# EasyEDA Pro project 03_SigPart.epro

# Schematic Schematic3
Create Date: 2024-06-30; Page Name: P1; Project Name: 264母板; Schematic Name: Schematic3; Update Date: 2024-08-02; Company: 嘉立创EDA; Page Size: A3; Version: V1.0
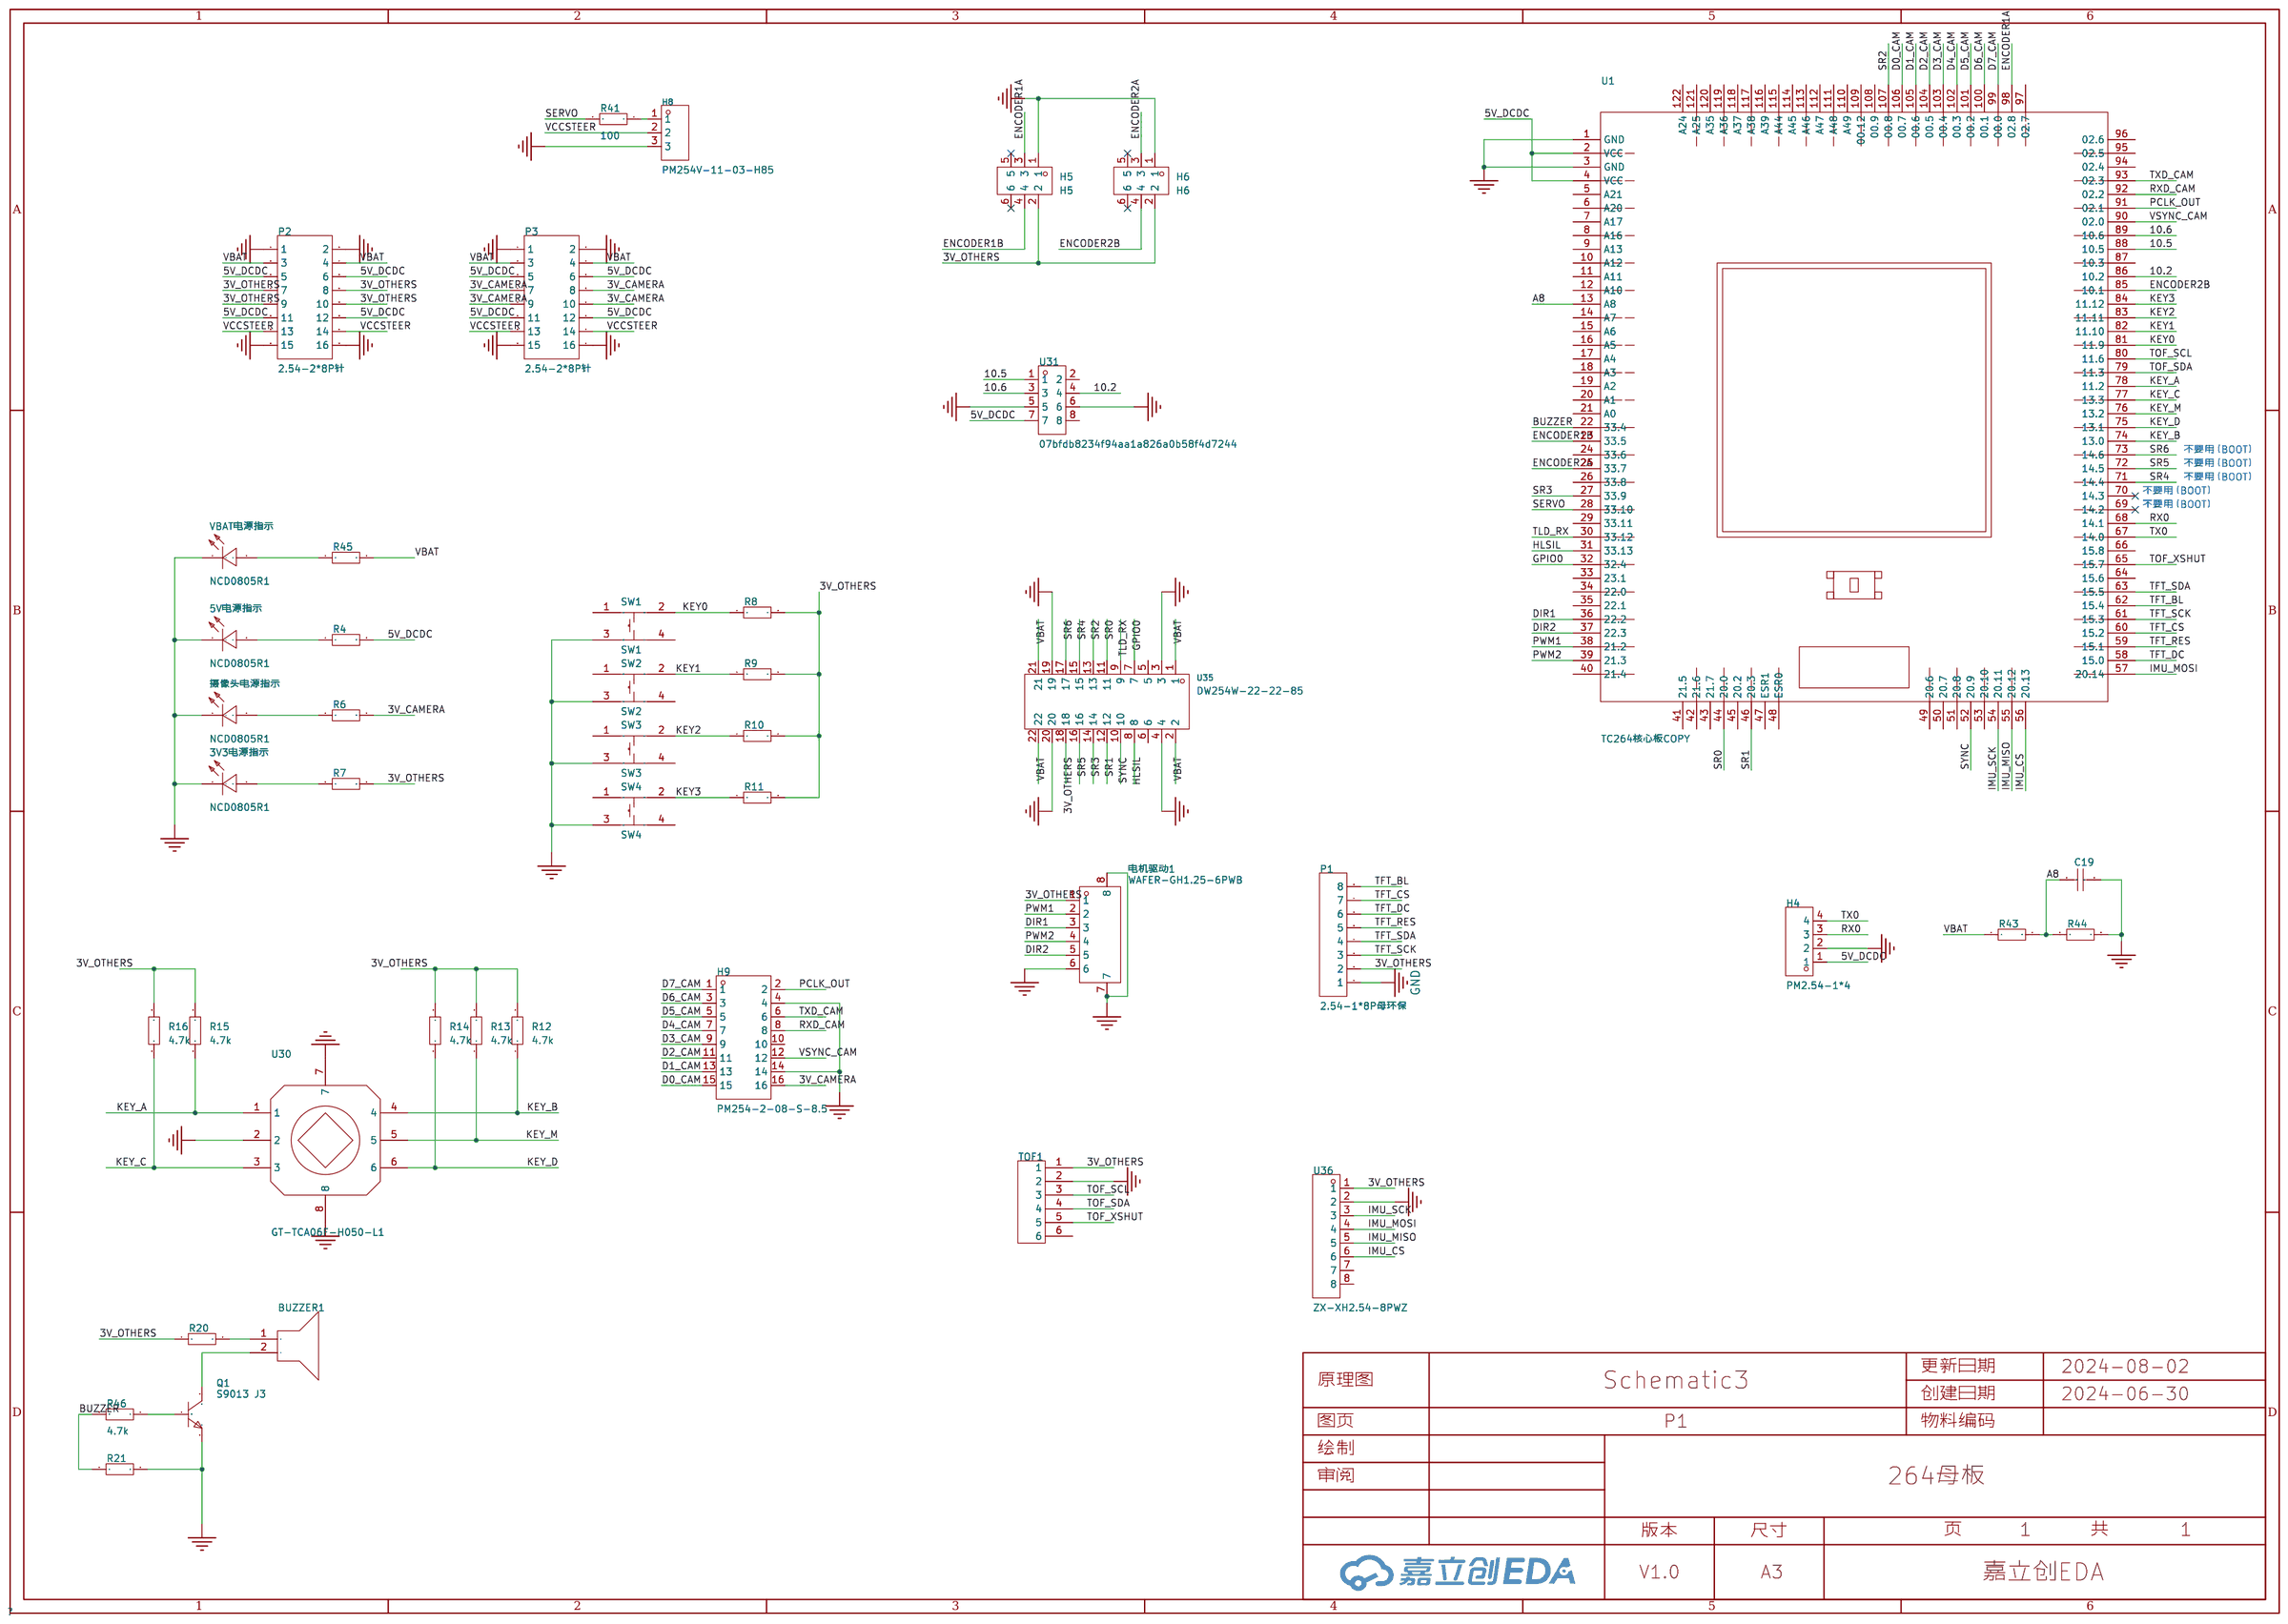
[diagram p0: schematic sheet]

## Parts
3V3电源指示  NCD0805R1  [LED0805-RD]
5V电源指示  NCD0805R1  [LED0805-RD]
BUZZER1  SFN-1270-0540-35P5.0  [BUZ-TH_BD12.5-P5.00-D0.9]
C19  100nF  [C0805]
H4  PM2.54-1*4  [HDR-TH_4P-P2.54-V-F]
H5  H5  [HDR-SMD_6P-P2.54-V-M-R2-C5-S7.4]
H6  H6  [HDR-SMD_6P-P2.54-V-M-R2-C5-S7.4]
H8  PM254V-11-03-H85  [HDR-TH_3P-P2.54-V-F]
H9  PM254-2-08-S-8.5  [HDR-SMD_16P-P2.54-V-F-R2-C8-LS7.1]
P1  2.54-1*8P母环保  [HDR-TH_8P-P2.54-V-F-1]
P2  2.54-2*8P针  [HDR-TH_16P-P2.54-V-M-R2-C8-S2.54]
P3  2.54-2*8P针  [HDR-TH_16P-P2.54-V-M-R2-C8-S2.54]
Q1  S9013 J3  [SOT-23-3_L2.9-W1.3-P1.90-LS2.4-BR]
R4  4.7k  [R0805]
R6  4.7k  [R0805]
R7  4.7k  [R0805]
R8  4.7k  [R0805]
R9  4.7k  [R0805]
R10  4.7k  [R0805]
R11  4.7k  [R0805]
R12  4.7k  [R0805]
R13  4.7k  [R0805]
R14  4.7k  [R0805]
R15  4.7k  [R0805]
R16  4.7k  [R0805]
R20  10R  [R0805]
R21  10k  [R0805]
R41  100  [R0805]
R43  30k  [R0805]
R44  10k  [R0805]
R45  4.7k  [R0805]
R46  4.7k  [R0805]
SW1  SW1  [SW-SMD_4P-L4.2-W3.3-P2.15-LS5.1]
SW2  SW2  [SW-SMD_4P-L4.2-W3.3-P2.15-LS5.1]
SW3  SW3  [SW-SMD_4P-L4.2-W3.3-P2.15-LS5.1]
SW4  SW4  [SW-SMD_4P-L4.2-W3.3-P2.15-LS5.1]
TOF1  -  [CONN-TH_6P-P2.50_XH-6A]
U1  TC264核心板COPY  [TC264逐飞]
U30  GT-TCA06F-H050-L1  [KEY-SMD_GT-TCA06F-H050-L1]
U31  07bfdb8234f94aa1a826a0b58f4d7244  [HDR-TH_8P-P2.54-V-F-R2-C4-S2.54]
U35  DW254W-22-22-85  [CONN-TH_22P-P2.54_DEALON_DW254W-22-22-85]
U36  ZX-XH2.54-8PWZ  [CONN-TH_8P-P2.50_ZX-XH2.54-8PWZ]
VBAT电源指示  NCD0805R1  [LED0805-RD]
摄像头电源指示  NCD0805R1  [LED0805-RD]
电机驱动1  WAFER-GH1.25-6PWB  [CONN-SMD_6P-P1.25_XUNPU_WAFER-GH1.25-6PWB]

## Library data of the parts
3V3电源指示 5V电源指示 VBAT电源指示 摄像头电源指示 = LED_0805: 发光颜色:红灯;; LCSC Part Name: 红灯; Supplier Part: C84256; Manufacturer: 国星光电; Supplier Footprint: 0805; JLCPCB Part Class: 基础库; Datasheet: https://atta.szlcsc.com/upload/public/pdf/source/20200820/C84256_F0A75A43B3EAD75808600A0514C76B99.pdf; Supplier: LCSC; Emitted Color: 红灯
BUZZER1 = BUZZER: 驱动方式：无源(外部驱动) 构造类型：压电式 额定电压：5V 频率：4000Hz 声压(SPL)：80dB@5V,10cm 直径(φD)：12.6mm 高度：7.5mm; Supplier Part: C3015481; Manufacturer: SS(海旭); Supplier Footprint: 插件,D=12.5mm; JLCPCB Part Class: 扩展库; Datasheet: https://atta.szlcsc.com/upload/public/pdf/source/20220517/E2F404692071743447D3DA4216E14D26.pdf; Supplier: LCSC
C19 = 电容-0805C
H4 = PM2.54-1*4: 排数:单排;总孔位数:4;间距:2.54mm;插孔结构:1x4P;行距:2.54mm;安装类型:直插;圆孔/方孔:方孔;额定电流:2.5A;插孔方向:顶部;塑高:8.5mm;工作温度范围:-40℃~+105℃;; LCSC Part Name: 2.54mm 1x4P; Supplier Part: C5116530; Manufacturer: ZHOURI(洲日); Supplier Footprint: 插件,P=2.54mm; JLCPCB Part Class: 扩展库; Datasheet: https://atta.szlcsc.com/upload/public/pdf/source/20220729/3385E3C3A9122AF204A83235A2975C64.pdf; Supplier: LCSC; Number of Rows: 单排; Number of Holes: 4; Pitch: 2.54mm; Holes Structure: 1x4P; Row Spacing: 2.54mm; Mounting Type: 直插; Circular Hole / Square Hole: 方孔; Current Rating (Max): 2.5A; Holes Direction: 顶部; Insulation Height: 8.5mm; Operating Temperature Range: -40℃~+105℃
H5 H6 = X6521WVS-2x03H-C60D74: 插针结构:2x3P;间距:2.54mm;行距:2.54mm;圆针/方针:方针;安装类型:立贴;排数:双排;总PIN位数:6P;额定电流:3A;额定电压:250V;配合针长度:6mm;塑高:2.5mm;端接针长度:-;触头材质:黄铜;触头镀层:金;工作温度范围:-40℃~+105℃;焊接温度(最大值):260℃;颜色:黑色;; LCSC Part Name: 间距:2.54mm 2x3P 立贴 方针; Supplier Part: C780054; Manufacturer: XKB Connectivity(中国星坤); Supplier Footprint: SMD,P=2.54mm; Datasheet: https://atta.szlcsc.com/upload/public/pdf/source/20211009/E3239EE5247E6BAFECB8B74A4FCF9AB8.pdf; Supplier: LCSC; Pin Structure: 2x3P; Pitch: 2.54mm; Row Spacing: 2.54mm; Circluar Pins/Square Pins: 方针; Mounting Type: 立贴; Number of Rows: 双排; Number of Pins: 6P; Current Rating (Max): 3A; Voltage Rating (Max): 250V; Length of Mating Pin: 6mm; Insulation Height: 2.5mm; Contact Material: 黄铜; Contact Plating: 金; Operating Temperature Range: -40℃~+105℃; Soldering Temperature(Max): 260℃; Color: 黑色
H8 = PM254_1*3: 排数:单排;总孔位数:3P;间距:2.54mm;插孔结构:1x3P;; LCSC Part Name: 2.54mm 1x3P; Supplier Part: C541850; Manufacturer: XFCN(兴飞); Supplier Footprint: 插件,P=2.54mm; JLCPCB Part Class: 扩展库; Datasheet: https://atta.szlcsc.com/upload/public/pdf/source/20200518/C541849_85853D71FC67C51915A806977A588FDA.pdf; Supplier: LCSC; Number of Rows: 单排; Number of Holes: 3P; Pitch: 2.54mm; Holes Structure: 1x3P; Mounting Type: 直插; Contact Material: 黄铜
H9 = PM254-2-08-S-8.5: 插孔结构:2x8P;间距:2.54mm;行距:2.54mm;圆孔/方孔:方孔;安装类型:立贴;排数:双排;总孔位数:16P;额定电流:3A;插孔方向:顶部;塑高:8.5mm;触头材质:铜合金;工作温度范围:-40℃~+105℃;焊接温度(最大值):260℃@5S;; LCSC Part Name: 2x8P 间距:2.54mm 立贴; Supplier Part: C3975153; Manufacturer: HCTL(华灿天禄); Supplier Footprint: SMD,P=2.54mm; Datasheet: https://atta.szlcsc.com/upload/public/pdf/source/20230609/7C6F8D8E301C6BBC8F19D55951C36597.pdf; Supplier: LCSC; Holes Structure: 2x8P; Pitch: 2.54mm; Row Spacing: 2.54mm; Circular Hole / Square Hole: 方孔; Mounting Type: 立贴; Number of Rows: 双排; Number of Holes: 16P; Current Rating (Max): 3A; Holes Direction: 顶部; Insulation Height: 8.5mm; Contact Material: 铜合金; Operating Temperature Range: -40℃~+105℃; Soldering Temperature(Max): 260℃@5S
P1 = PM2.54-1*8P: 排数:单排;总孔位数:8;间距:2.54mm;插孔结构:1x8P;行距:-;安装类型:直插;塑高:-;触头材质:-;触头镀层:-;; LCSC Part Name: 2.54mm 1x8P; Supplier Part: C27438; Manufacturer: BOOMELE(博穆精密); Supplier Footprint: 插件,P=2.54mm; JLCPCB Part Class: 扩展库; Datasheet: https://atta.szlcsc.com/upload/public/pdf/source/20151109/1457707554453.pdf; Supplier: LCSC; Number of Rows: 单排; Number of Holes: 8; Pitch: 2.54mm; Holes Structure: 1x8P; Mounting Type: 直插
P2 P3 = PZ2.54-2*8P: 排数:双排;总PIN位数:16;间距:2.54mm;插针结构:2x8P;行距:2.54mm;安装类型:直插;圆针/方针:方针;额定电流:-;额定电压:-;配合针长度:5.9mm;塑高:2.54mm;端接针长度:-;触头材质:-;触头镀层:-;工作温度范围:-;焊接温度(最大值):-;颜色:黑色;; LCSC Part Name: 2.54mm 2x8P 直插 方针; Supplier Part: C68234; Manufacturer: BOOMELE(博穆精密); Supplier Footprint: 直插,P=2.54mm; JLCPCB Part Class: 扩展库; Datasheet: https://atta.szlcsc.com/upload/public/pdf/source/20221018/3E9408392E35E6F57A28985E5F7BF5C9.pdf; Supplier: LCSC; Number of Rows: 双排; Number of Pins: 16; Pitch: 2.54mm; Pin Structure: 2x8P; Row Spacing: 2.54mm; Mounting Type: 直插; Circluar Pins/Square Pins: 方针; Length of Mating Pin: 5.9mm; Insulation Height: 2.54mm; Color: 黑色
Q1 = S9013 J3: 晶体管类型:NPN;集电极电流(Ic):500mA;集射极击穿电压(Vceo):25V;功率(Pd):300mW;直流电流增益(hFE@Ic,Vce):200@50mA,1V;; LCSC Part Name: NPN 电流:500mA 耐压:25V H档(200-350); Supplier Part: C6749; Manufacturer: CJ(江苏长电/长晶); Supplier Footprint: SOT-23; JLCPCB Part Class: 基础库; Datasheet: https://atta.szlcsc.com/upload/public/pdf/source/20140809/1457707213610.pdf; Supplier: LCSC; Transistor Type: NPN; Collector Current (Ic): 500mA; Collector-Emitter Breakdown Voltage (Vceo): 25V; Power Dissipation (Pd): 300mW; DC Current Gain (hFE@Ic,Vce): 200@50mA,1V; Transition Frequency (fT): 150MHz; Collector Cut-Off Current (Icbo): 100nA; Collector-Emitter Saturation Voltage (VCE(sat)@Ic,Ib): 600mV@500mA,50mA
R4 R6-R16 R20 R21 R41 R43-R46 = 电阻_0805: 电阻类型:厚膜电阻;阻值:1kΩ;精度:±1%;功率:125mW;温度系数:±100ppm/℃;最大工作电压:150V;工作温度范围:-55℃~+155℃;
SW1-SW4 = K2-1808SN-A3SW-01: 作用力:180gf;安装方式:立贴;开关长度:4.2mm;开关宽度:3.25mm;开关高度:2.5mm;触点电流:50mA;额定电压(DC):12V;绝缘电阻:100MΩ;机械寿命:10万次;; LCSC Part Name: 3*4*2.5 贴片开关180G; Supplier Part: C2690012; Manufacturer: 韩国韩荣; Supplier Footprint: SMD; JLCPCB Part Class: 扩展库; Datasheet: https://atta.szlcsc.com/upload/public/pdf/source/20180927/C283535_7E7907F3E7B6C1691E1DC87E363D082A.pdf; Supplier: LCSC; Operating Force: 180gf; Mounting Style: 立贴; Switch Length: 4.2mm; Switch Width: 3.25mm; Switch Height: 2.5mm; Contact Current: 50mA; Voltage Rating (DC): 12V; Insulation Resistance: 100MΩ; Mechanical Life: 10万次; Operating Temperature: -25℃~+85℃
TOF1 = XH-6直插
U1 = TC264核心板 COPY: Supplier: 逐飞
U30 = GT-TCA06F-H050-L1: 开关长度:7.5mm;开关宽度:7.5mm;开关高度:5mm;机械寿命:-;; LCSC Part Name: 斜五向轻触开关 H5.0mm 400gf 带贴片脚; Supplier Part: C3019725; Manufacturer: G-Switch(品赞); Supplier Footprint: SMD; JLCPCB Part Class: 扩展库; Datasheet: https://atta.szlcsc.com/upload/public/pdf/source/20220627/F7A64F0F346B15FF80DEC5591ADA8118.pdf; Supplier: LCSC; Switch Length: 7.5mm; Switch Width: 7.5mm; Switch Height: 5mm
U31 = PM2.54-2*4: 排数:双排;总孔位数:8;间距:2.54mm;插孔结构:2x4P;行距:2.54mm;安装类型:直插;圆孔/方孔:方孔;额定电流:2.5A;额定电压:-;插孔方向:顶部;塑高:8.5mm;工作温度范围:-40℃~+105℃;; LCSC Part Name: 2.54mm 2x4P; Supplier Part: C2977588; Manufacturer: ZHOURI(洲日); Manufacturer Part: 2.54-2*4; Supplier Footprint: 插件,P=2.54mm; JLCPCB Part Class: 扩展库; Datasheet: https://atta.szlcsc.com/upload/public/pdf/source/20220328/363EB391BC0EB759CF231FC910753CBE.pdf; Supplier: LCSC; Number of Rows: 双排; Number of Holes: 8; Pitch: 2.54mm; Holes Structure: 2x4P; Row Spacing: 2.54mm; Mounting Type: 直插; Circular Hole / Square Hole: 方孔; Current Rating (Max): 2.5A; Holes Direction: 顶部; Insulation Height: 8.5mm; Operating Temperature Range: -40℃~+105℃
U35 = DW254W-22-22-85: 插孔结构:2x11P;间距:2.54mm;安装类型:弯插;排数:双排;; LCSC Part Name: 2x11P 间距:2.54mm 弯插; Supplier Part: C7506650; Manufacturer: DEALON(德艺隆); Supplier Footprint: 插件,P=2.54mm; Datasheet: https://atta.szlcsc.com/upload/public/pdf/source/20211231/D29517537FCFFABF14C4453E96D14918.pdf; Supplier: LCSC; Holes Structure: 2x11P; Pitch: 2.54mm; Mounting Type: 弯插; Number of Rows: 双排
U36 = ZX-XH2.54-8PWZ: 插针结构:1x8P;间距:2.54mm;安装方式:弯插;参考系列:XH;总PIN数:8P;排数:1;每排PIN数:8;行距:-;额定电流:3A;触头材质:黄铜;触头镀层:锡;工作温度范围:-25℃~+85℃;; Supplier Part: C7429647; Manufacturer: Megastar(兆星); Supplier Footprint: 弯插,P=2.54mm; JLCPCB Part Class: 扩展库; Datasheet: https://atta.szlcsc.com/upload/public/pdf/source/20230619/825E28BFFB9F3B9EEDAD896C78D625B2.pdf; Supplier: LCSC; Pins Structure: 1x8P; Pitch: 2.54mm; Mounting Style: 弯插; Reference Series: XH; Number of Pins: 8P; Number of Rows: 1; Number of PINs Per Row: 8; Current Rating (Max): 3A; Contact Material: 黄铜; Contact Plating: 锡; Operating Temperature Range: -25℃~+85℃
电机驱动1 = WAFER-GH1.25-6PWB: 插针结构:1x6P;间距:1.25mm;安装方式:卧贴;参考系列:GH;总PIN数:6P;排数:1;每排PIN数:6;额定电流:1A;工作温度范围:-25℃~+85℃;; LCSC Part Name: 1x6P 间距:1.25mm 卧贴 系列:GH; Supplier Part: C3029381; Manufacturer: XUNPU(讯普); Supplier Footprint: SMD,P=1.25mm,卧贴; Datasheet: https://atta.szlcsc.com/upload/public/pdf/source/20220527/CB8773BFB0913C3B8ABD62CB38BA101A.pdf; Supplier: LCSC; Pins Structure: 1x6P; Pitch: 1.25mm; Mounting Style: 卧贴; Reference Series: GH; Number of Pins: 6P; Number of Rows: 1; Number of PINs Per Row: 6; Current Rating (Max): 1A; Operating Temperature Range: -25℃~+85℃

## Nets
3V_CAMERA: H9.16 P3.7 P3.8 P3.9 P3.10 R6.2
3V_OTHERS: H5.2 H6.2 P1.2 P2.7 P2.8 P2.9 P2.10 R7.2 R8.2 R9.2 R10.2 R11.2 R12.2 R13.2 R14.2 R15.2 R16.2 R20.1 TOF1.1 U35.18 U36.1 电机驱动1.1
5V_DCDC: H4.1 P2.5 P2.6 P2.11 P2.12 P3.5 P3.6 P3.11 P3.12 R4.2 U1.2(VCC) U1.4(VCC) U31.7
GND: 3V3电源指示.1(-) 5V电源指示.1(-) C19.2 H4.2 H5.1 H6.1 H8.3 H9.4 H9.14 P1.1 P2.1 P2.2 P2.15 P2.16 P3.1 P3.2 P3.15 P3.16 Q1.2(E) R21.2 R44.2 SW1.3 SW2.3 SW3.3 SW4.3 TOF1.2 U1.1(GND) U1.3(GND) U30.2 U30.7 U30.8 U31.5 U31.6 U35.3 U35.4 U35.19 U35.20 U36.2 VBAT电源指示.1(-) 摄像头电源指示.1(-) 电机驱动1.6 电机驱动1.7 电机驱动1.8
VBAT: P2.3 P2.4 P3.3 P3.4 R43.1 R45.2 U35.1 U35.2 U35.21 U35.22
VCCSTEER: H8.2 P2.13 P2.14 P3.13 P3.14
10.2: U1.86(10.2) U31.4
10.5: U1.88(10.5) U31.1
10.6: U1.89(10.6) U31.3
A8: C19.1 R43.2 R44.1 U1.13(A8)
BUZZER: R21.1 R46.2 U1.22(33.4)
D0_CAM: H9.15 U1.106(00.7)
D1_CAM: H9.13 U1.105(00.6)
D2_CAM: H9.11 U1.104(00.5)
D3_CAM: H9.9 U1.103(00.4)
D4_CAM: H9.7 U1.102(00.3)
D5_CAM: H9.5 U1.101(00.2)
D6_CAM: H9.3 U1.100(00.1)
D7_CAM: H9.1 U1.99(00.0)
DIR1: U1.36(22.2) 电机驱动1.3
DIR2: U1.37(22.3) 电机驱动1.5
ENCODER1A: H5.3 U1.98(02.8)
ENCODER1B: H5.4 U1.23(33.5)
ENCODER2A: H6.3 U1.25(33.7)
ENCODER2B: H6.4 U1.85(10.1)
GPIO0: U1.32(32.4) U35.7
HLSIL: U1.31(33.13) U35.8
IMU_CS: U1.56(20.13) U36.6
IMU_MISO: U1.55(20.12) U36.5
IMU_MOSI: U1.57(20.14) U36.4
IMU_SCK: U1.54(20.11) U36.3
KEY0: R8.1 SW1.2 U1.81(11.9)
KEY1: R9.1 SW2.2 U1.82(11.10)
KEY2: R10.1 SW3.2 U1.83(11.11)
KEY3: R11.1 SW4.2 U1.84(11.12)
KEY_A: R15.1 U1.78(11.2) U30.1
KEY_B: R12.1 U1.74(13.0) U30.4
KEY_C: R16.1 U1.77(13.3) U30.3
KEY_D: R14.1 U1.75(13.1) U30.6
KEY_M: R13.1 U1.76(13.2) U30.5
PCLK_OUT: H9.2 U1.91(02.1)
PWM1: U1.38(21.2) 电机驱动1.2
PWM2: U1.39(21.3) 电机驱动1.4
RX0: H4.3 U1.68(14.1)
RXD_CAM: H9.8 U1.92(02.2)
SERVO: R41.2 U1.28(33.10)
SR0: U1.44(20.0) U35.11
SR1: U1.46(20.3) U35.12
SR2: U1.107(00.8) U35.13
SR3: U1.27(33.9) U35.14
SR4: U1.71(14.4) U35.15
SR5: U1.72(14.5) U35.16
SR6: U1.73(14.6) U35.17
SYNC: U1.52(20.9) U35.10
TFT_BL: P1.8 U1.62(15.4)
TFT_CS: P1.7 U1.60(15.2)
TFT_DC: P1.6 U1.58(15.0)
TFT_RES: P1.5 U1.59(15.1)
TFT_SCK: P1.3 U1.61(15.3)
TFT_SDA: P1.4 U1.63(15.5)
TLD_RX: U1.30(33.12) U35.9
TOF_SCL: TOF1.3 U1.80(11.6)
TOF_SDA: TOF1.4 U1.79(11.3)
TOF_XSHUT: TOF1.5 U1.65(15.7)
TX0: H4.4 U1.67(14.0)
TXD_CAM: H9.6 U1.93(02.3)
VSYNC_CAM: H9.12 U1.90(02.0)
$1N2787: 5V电源指示.2(+) R4.1
$1N2799: R6.1 摄像头电源指示.2(+)
$1N2800: 3V3电源指示.2(+) R7.1
$1N2856: BUZZER1.1(+) R20.2
$1N2858: BUZZER1.2(-) Q1.3(C)
$1N3556: R45.1 VBAT电源指示.2(+)
$1N4756: H8.1 R41.1
$1N11903: Q1.1(B) R46.1

Not connected (* = marked no-connect by the designer): H5 5* 6*; H6 5* 6*; H9 10; SW1 1 4; SW2 1 4; SW3 1 4; SW4 1 4; TOF1 6; U1 5(A21) 6(A20) 7(A17) 8(A16) 9(A13) 10(A12) 11(A11) 12(A10) 14(A7) 15(A6) 16(A5) 17(A4) 18(A3) 19(A2) 20(A1) 21(A0) 24(33.6) 26(33.8) 29(33.11) 33(23.1) 34(22.0) 35(22.1) 40(21.4) 41(21.5) 42(21.6) 43(21.7) 45(20.2) 47(ESR1) 48(ESR0) 49(20.6) 50(20.7) 51(20.8) 53(20.10) 64(15.6) 66(15.8) 69(14.2)* 70(14.3)* 87(10.3) 94(02.4) 95(02.5) 96(02.6) 97(02.7) 108(00.9) 109(00.12) 110(A49) 111(A48) 112(A47) 113(A46) 114(A45) 115(A44) 116(A39) 117(A38) 118(A37) 119(A36) 120(A35) 121(A25) 122(A24); U31 2 8; U35 5 6; U36 7 8

## Notes on the sheet
- 不要用（BOOT）
- 不要用（BOOT）
- 不要用（BOOT）
- 不要用（BOOT）
- 不要用（BOOT）

# Board PCB4
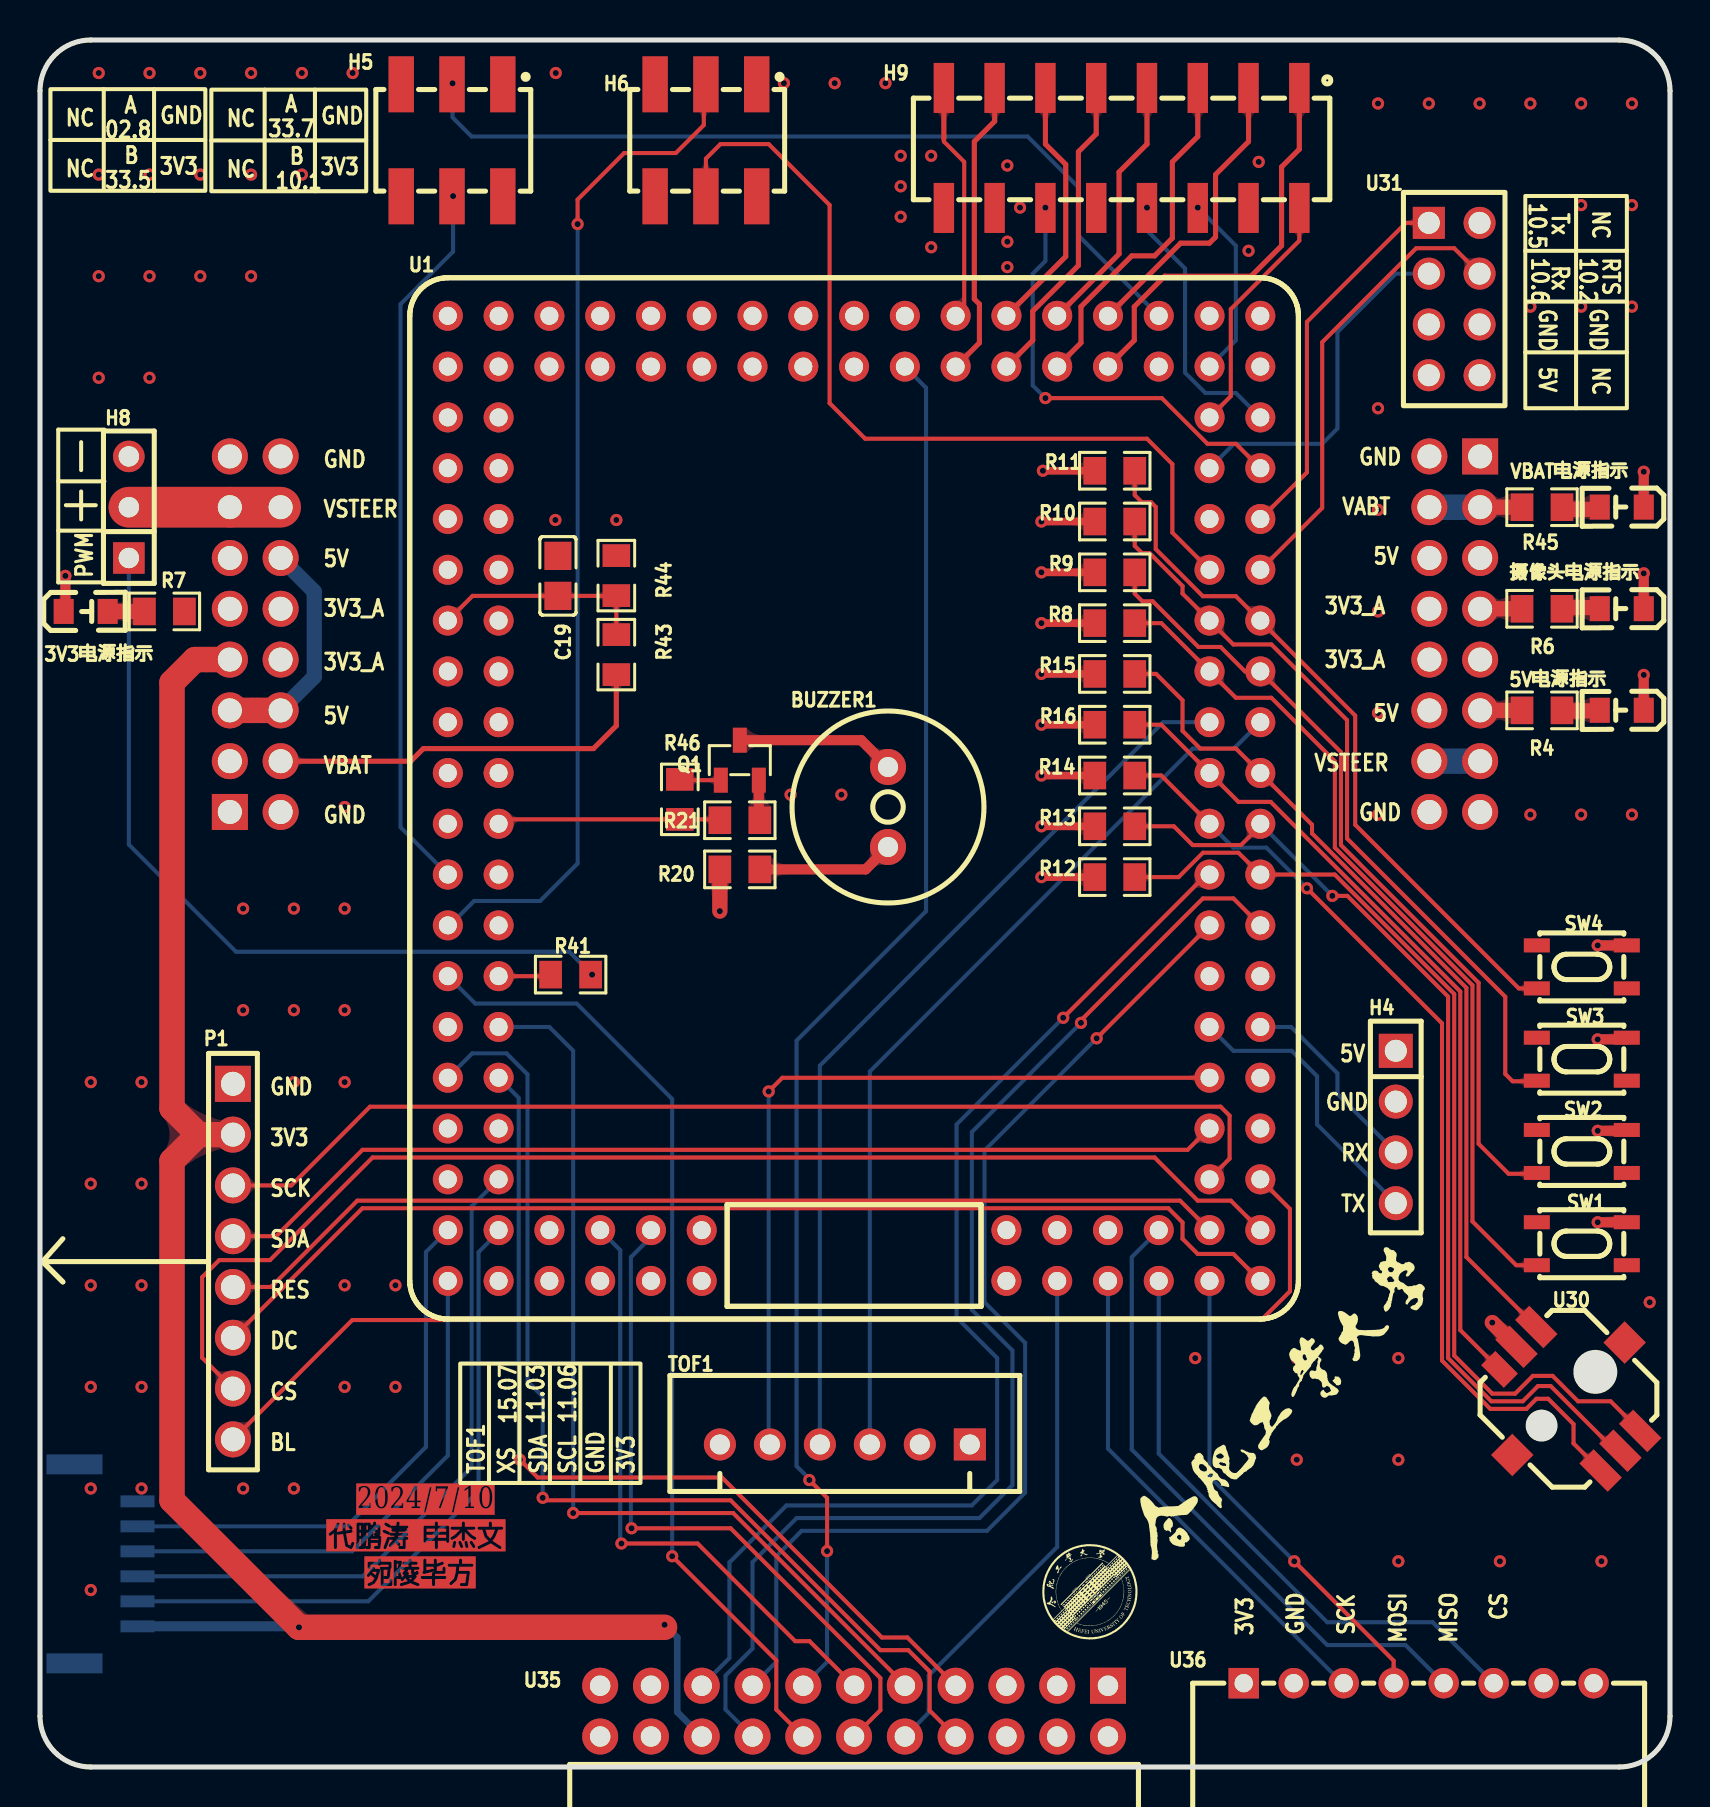
[diagram p1: board, top side]
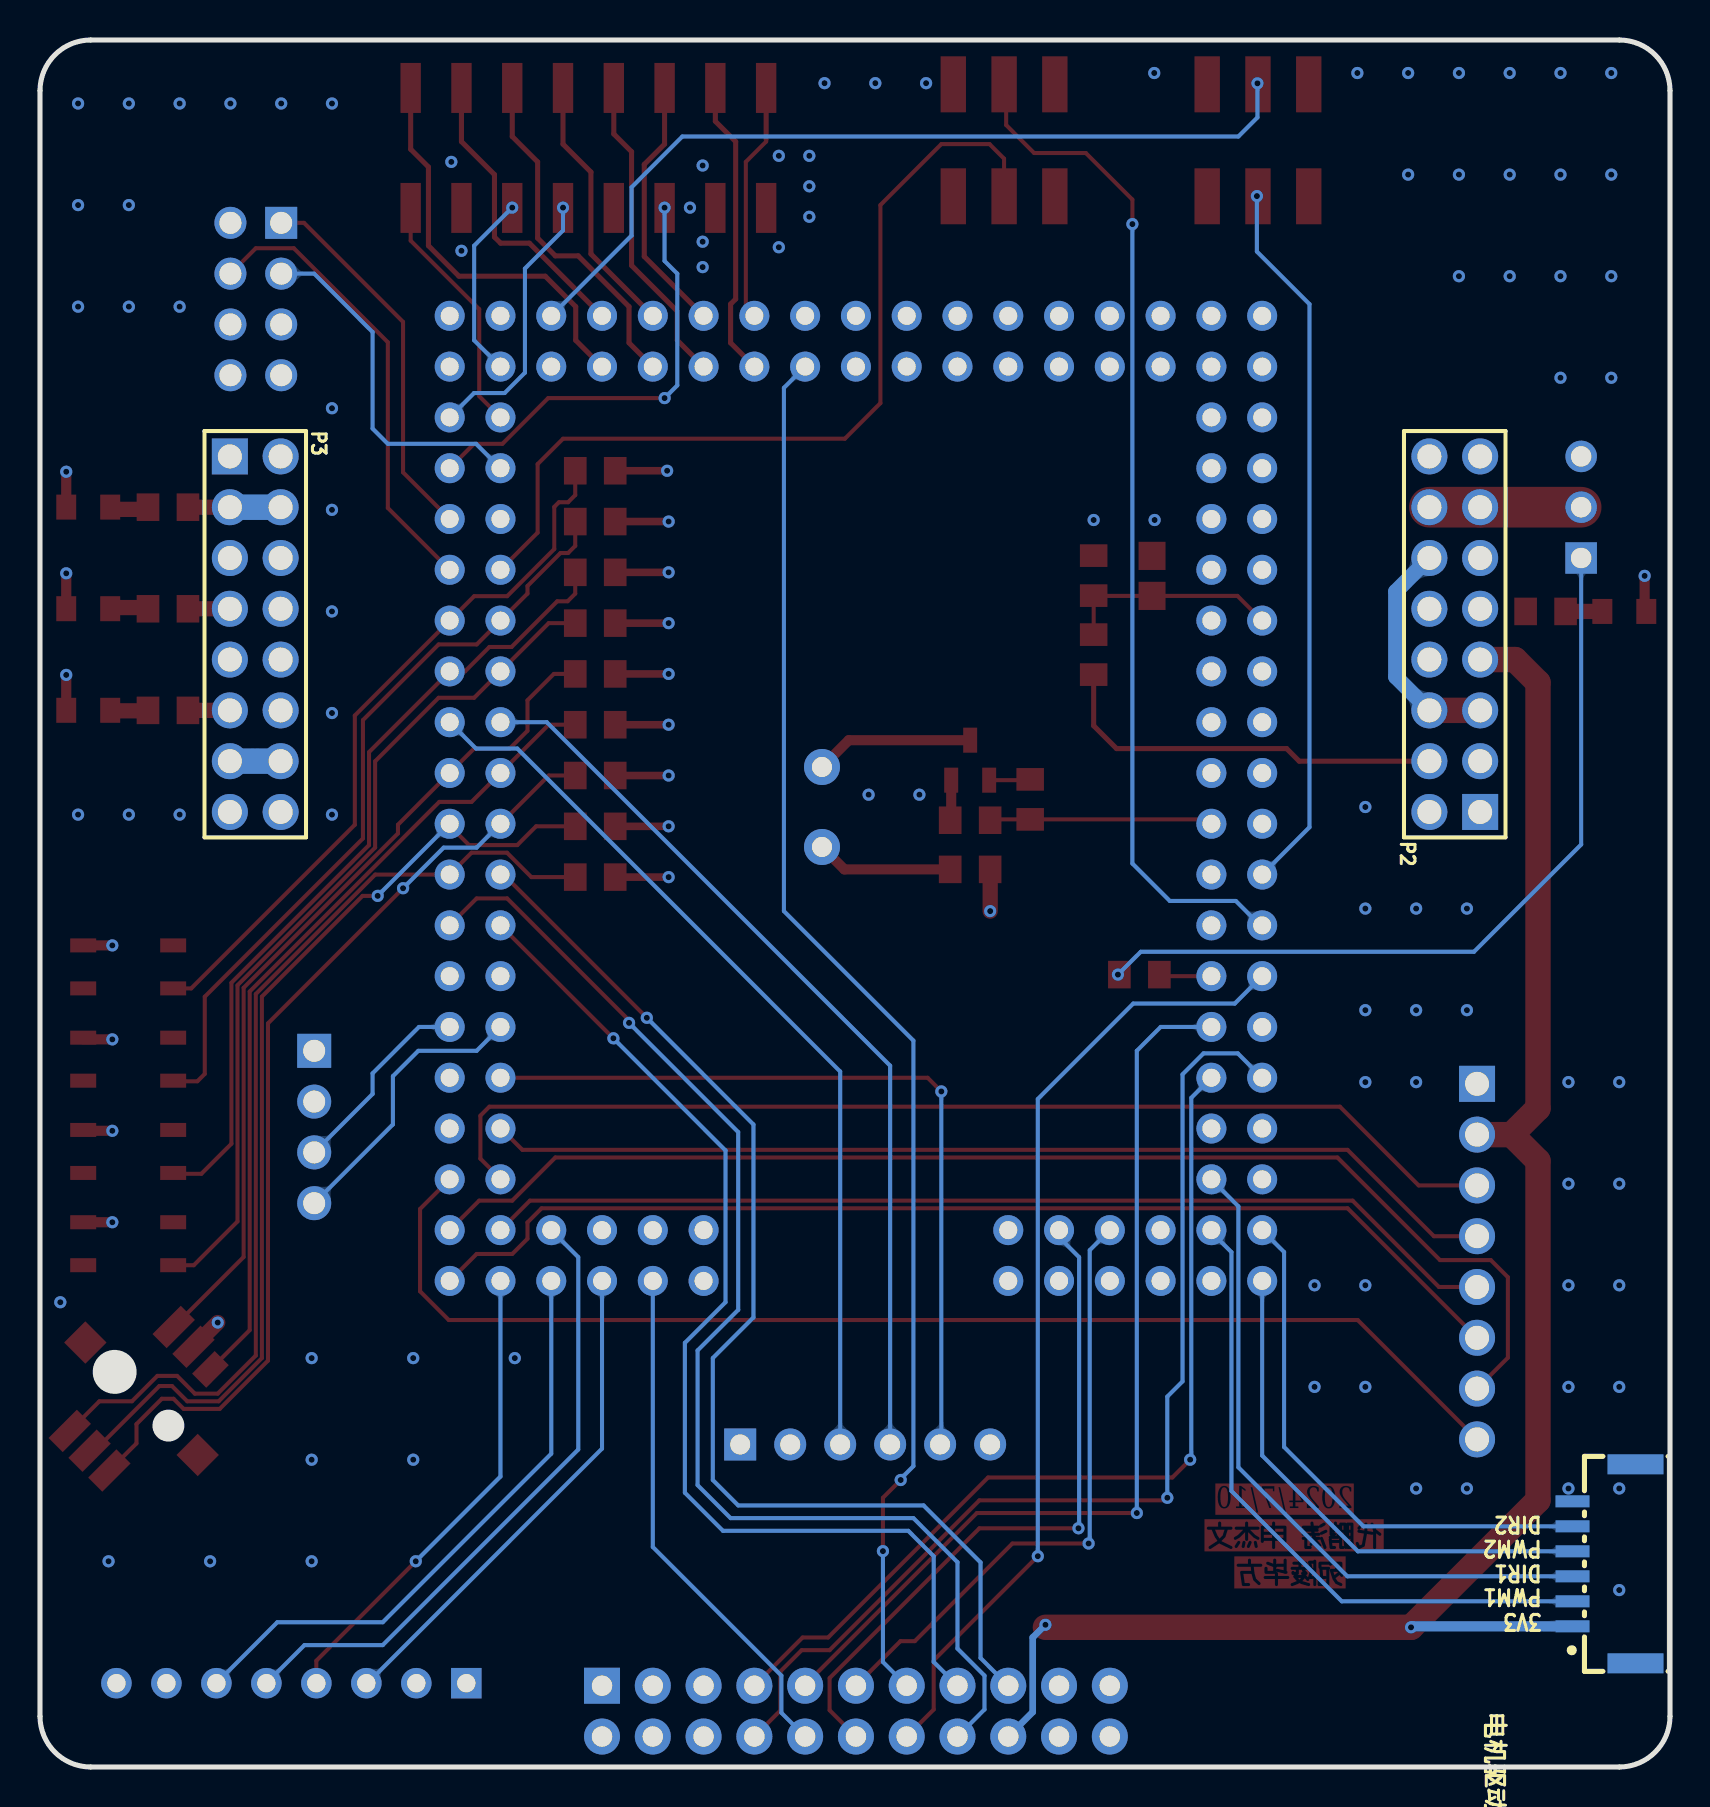
[diagram p2: board, bottom side, seen from below]

Outline 81.53 x 86.36 mm; copper layers: Top Layer, Inner1, Inner2, Bottom Layer. Coordinates in mm from the lower left corner of the outline.
Outline path: 0,83.82 0,2.54 arc(0.74,0.74) 2.54,0 78.99,0 arc(80.79,0.74) 81.53,2.54 81.53,83.82 arc(80.79,85.62) 78.99,86.36 2.54,86.36 arc(0.74,85.62) 0,83.82
Stack: Top Layer 0.035mm 外层铜厚1oz / Dielectric1 0.2104mm 7628 RC49% 8.6mil / Inner1 0.0152mm 内层铜厚 / Dielectric2 1.065mm 1.1mm H/HOZ 含铜 / Inner2 0.0152mm 内层铜厚 / Dielectric3 0.2104mm 7628 RC49% 8.6mil / Bottom Layer 0.035mm 外层铜厚1oz

## Design rules (mm)
template: 自定义配置
spacing copperThickness1oz (default): track to track 0.102, other pairs 0 to 0.3
spacing copperThickness2oz: track to track 0.203, other pairs 0.152 to 0.3
track width copperThickness1oz (default): min 0.127, default 0.203, max 2.54
track width copperThickness2oz: min 0.203, default 0.254, max 2.54
differential pair differentialPair (default): width min 0.127, default 0.254, max 2.54; gap min 0.152, default 0.152
via viaSize (default): diameter min 0.5, default 0.61, max 10; hole min 0.3, default 0.305, max 6.299
net 5V_DCDC uses PWR1
net VBAT uses PWR1
net 3V_OTHERS uses FULL
net 3V_CAMERA uses PWR1
pour e113 uses FULL
pour e2880 uses FULL
pour e4561 uses FULL
pour e4843 uses FULL
pour e5034 uses FULL
pour e5409 uses FULL
pour e6082 uses FULL
pour e6338 uses FULL
pour e6571 uses FULL
pour e8604 uses FULL
pour e8822 uses FULL
pour e8839 uses FULL
pour e8847 uses FULL
pour e373 uses FULL
pour e322 uses FULL

## Placement (name value [footprint] x y rotation side)
3V3电源指示  NCD0805R1  [LED0805-RD]  2.29 57.78 0 top
5V电源指示  NCD0805R1  [LED0805-RD]  79.12 52.84 180 top
BUZZER1  SFN-1270-0540-35P5.0  [BUZ-TH_BD12.5-P5.00-D0.9]  42.42 48.01 90 top
C19  100nF  [C0805]  25.91 59.56 90 top
H4  PM2.54-1*4  [HDR-TH_4P-P2.54-V-F]  67.82 32 270 top
H5  H5  [HDR-SMD_6P-P2.54-V-M-R2-C5-S7.4]  20.61 81.34 180 top
H6  H6  [HDR-SMD_6P-P2.54-V-M-R2-C5-S7.4]  33.31 81.34 180 top
H8  PM254V-11-03-H85  [HDR-TH_3P-P2.54-V-F]  4.44 63 90 top
H9  PM254-2-08-S-8.5  [HDR-SMD_16P-P2.54-V-F-R2-C8-LS7.1]  54.1 80.96 180 top
P1  2.54-1*8P母环保  [HDR-TH_8P-P2.54-V-F-1]  9.65 25.27 270 top
P2  2.54-2*8P针  [HDR-TH_16P-P2.54-V-M-R2-C8-S2.54]  10.77 56.65 90 bottom
P3  2.54-2*8P针  [HDR-TH_16P-P2.54-V-M-R2-C8-S2.54]  70.77 56.65 270 bottom
Q1  S9013 J3  [SOT-23-3_L2.9-W1.3-P1.90-LS2.4-BR]  35.01 50.35 270 top
R4  4.7k  [R0805]  75.13 52.84 180 top
R6  4.7k  [R0805]  75.13 57.92 180 top
R7  4.7k  [R0805]  6.22 57.78 0 top
R8  4.7k  [R0805]  53.76 57.2 180 top
R9  4.7k  [R0805]  53.76 59.74 180 top
R10  4.7k  [R0805]  53.76 62.28 180 top
R11  4.7k  [R0805]  53.76 64.82 180 top
R12  4.7k  [R0805]  53.76 44.5 180 top
R13  4.7k  [R0805]  53.76 47.04 180 top
R14  4.7k  [R0805]  53.76 49.58 180 top
R15  4.7k  [R0805]  53.76 54.66 180 top
R16  4.7k  [R0805]  53.76 52.12 180 top
R20  10R  [R0805]  35.01 44.89 0 top
R21  10k  [R0805]  35.01 47.34 0 top
R41  100  [R0805]  26.54 39.62 180 top
R43  30k  [R0805]  28.83 55.63 90 top
R44  10k  [R0805]  28.83 59.58 90 top
R45  4.7k  [R0805]  75.13 63 180 top
R46  4.7k  [R0805]  32 48.39 270 top
SW1  SW1  [SW-SMD_4P-L4.2-W3.3-P2.15-LS5.1]  77.12 26.17 180 top
SW2  SW2  [SW-SMD_4P-L4.2-W3.3-P2.15-LS5.1]  77.12 30.78 180 top
SW3  SW3  [SW-SMD_4P-L4.2-W3.3-P2.15-LS5.1]  77.12 35.39 180 top
SW4  SW4  [SW-SMD_4P-L4.2-W3.3-P2.15-LS5.1]  77.12 40.01 180 top
TOF1  -  [CONN-TH_6P-P2.50_XH-6A]  40.26 16.13 180 top
U1  TC264核心板COPY  [TC264逐飞]  41.36 53.52 0 top
U30  GT-TCA06F-H050-L1  [KEY-SMD_GT-TCA06F-H050-L1]  76.45 18.41 315 top
U31  07bfdb8234f94aa1a826a0b58f4d7244  [HDR-TH_8P-P2.54-V-F-R2-C4-S2.54]  70.74 73.41 270 top
U35  DW254W-22-22-85  [CONN-TH_22P-P2.54_DEALON_DW254W-22-22-85]  40.72 2.79 0 top
U36  ZX-XH2.54-8PWZ  [CONN-TH_8P-P2.50_ZX-XH2.54-8PWZ]  68.96 4.19 0 top
VBAT电源指示  NCD0805R1  [LED0805-RD]  79.12 63 180 top
摄像头电源指示  NCD0805R1  [LED0805-RD]  79.12 57.92 180 top
电机驱动1  WAFER-GH1.25-6PWB  [CONN-SMD_6P-P1.25_XUNPU_WAFER-GH1.25-6PWB]  3.3 10.16 90 bottom

## Footprints (pads in the part's own frame, mm; a bottom-side part is the same pattern mirrored in y, then rotated)
BUZ-TH_BD12.5-P5.00-D0.9
  round 1.8 hole 1: 1(-2,0) 2(2,0)
C0805
  rect 1.41x1.35 smd: 1(-1,0) 2(1,0)
CONN-SMD_6P-P1.25_XUNPU_WAFER-GH1.25-6PWB
  rect 0.6x1.7 smd: 1(-3.125,1.575) 2(-1.875,1.575) 3(-0.625,1.575) 4(0.625,1.575) 5(1.875,1.575) 6(3.125,1.575)
  rect 1x2.8 smd: 7(4.975,-1.575) 8(-4.975,-1.575)
CONN-TH_6P-P2.50_XH-6A
  rect 1.6x1.6 hole 1.001: 1(-6.251,0)
  round 1.6 hole 1.001: 2(-3.749,0) 3(-1.25,0) 4(1.25,0) 5(3.749,0) 6(6.251,0)
CONN-TH_8P-P2.50_ZX-XH2.54-8PWZ
  rect 1.524x1.524 hole 0.914: 1(-8.75,0)
  round 1.524 hole 0.914: 2(-6.25,0) 3(-3.75,0) 4(-1.25,0) 5(1.25,0) 6(3.75,0) 7(6.25,0) 8(8.75,0)
CONN-TH_22P-P2.54_DEALON_DW254W-22-22-85
  rect 1.8x1.8 hole 1.02: 1(12.7,1.27)
  round 1.8 hole 1.02: 2(12.7,-1.27) 3(10.16,1.27) 4(10.16,-1.27) 5(7.62,1.27) 6(7.62,-1.27) 7(5.08,1.27) 8(5.08,-1.27) 9(2.54,1.27) 10(2.54,-1.27) 11(0,1.27) 12(0,-1.27) 13(-2.54,1.27) 14(-2.54,-1.27) 15(-5.08,1.27) 16(-5.08,-1.27) 17(-7.62,1.27) 18(-7.62,-1.27) 19(-10.16,1.27) 20(-10.16,-1.27) 21(-12.7,1.27) 22(-12.7,-1.27)
HDR-SMD_6P-P2.54-V-M-R2-C5-S7.4
  rect 1.27x2.8 smd: 1(-2.54,-2.8) 2(-2.54,2.8) 3(0,-2.8) 4(0,2.8) 5(2.54,-2.8) 6(2.54,2.8)
HDR-SMD_16P-P2.54-V-F-R2-C8-LS7.1
  rect 1.02x2.5 smd: 1(-8.89,-3) 2(-8.89,3) 3(-6.35,-3) 4(-6.35,3) 5(-3.81,-3) 6(-3.81,3) 7(-1.27,-3) 8(-1.27,3) 9(1.27,-3) 10(1.27,3) 11(3.81,-3) 12(3.81,3) 13(6.35,-3) 14(6.35,3) 15(8.89,-3) 16(8.89,3)
HDR-TH_3P-P2.54-V-F
  rect 1.575x1.575 hole 1.02: 1(-2.54,0)
  round 1.575 hole 1.02: 2(0,0) 3(2.54,0)
HDR-TH_4P-P2.54-V-F
  rect 1.7x1.7 hole 1.1: 1(-3.81,0)
  round 1.7 hole 1.1: 2(-1.27,0) 3(1.27,0) 4(3.81,0)
HDR-TH_8P-P2.54-V-F-1
  rect 1.8x1.8 hole 1.2: 1(-8.89,0)
  round 1.8 hole 1.2: 2(-6.35,0) 3(-3.81,0) 4(-1.27,0) 5(1.27,0) 6(3.81,0) 7(6.35,0) 8(8.89,0)
HDR-TH_8P-P2.54-V-F-R2-C4-S2.54
  rect 1.6x1.6 hole 1.1: 1(-3.81,-1.27)
  round 1.6 hole 1.1: 2(-3.81,1.27) 3(-1.27,-1.27) 4(-1.27,1.27) 5(1.27,-1.27) 6(1.27,1.27) 7(3.81,-1.27) 8(3.81,1.27)
HDR-TH_16P-P2.54-V-M-R2-C8-S2.54
  rect 1.8x1.8 hole 1.2: 1(-8.89,-1.27)
  round 1.8 hole 1.2: 2(-8.89,1.27) 3(-6.35,-1.27) 4(-6.35,1.27) 5(-3.81,-1.27) 6(-3.81,1.27) 7(-1.27,-1.27) 8(-1.27,1.27) 9(1.27,-1.27) 10(1.27,1.27) 11(3.81,-1.27) 12(3.81,1.27) 13(6.35,-1.27) 14(6.35,1.27) 15(8.89,-1.27) 16(8.89,1.27)
KEY-SMD_GT-TCA06F-H050-L1
  rect 2x1 smd: 1(-3.675,1.4) 2(-3.675,0) 4(3.675,1.4) 5(3.675,0) 6(3.675,-1.4)
  rect 1.6x1 smd: 3(-3.475,-1.4)
  rect 1.5x1.5 smd: 7(0,3.975) 8(0,-3.975)
LED0805-RD
  rect 1x1.25 smd: 1(-1.1,0) 2(1.1,0)
R0805
  rect 1.133x1.377 smd: 1(-1,0) 2(1,0)
SOT-23-3_L2.9-W1.3-P1.90-LS2.4-BR
  rect 1.25x0.7 smd: 1(1,-0.95) 2(1,0.95) 3(-1,0)
SW-SMD_4P-L4.2-W3.3-P2.15-LS5.1
  rect 1.3x0.7 smd: 1(-2.25,1.075) 2(2.25,1.075) 3(-2.25,-1.075) 4(2.25,-1.075)
TC264逐飞
  round 1.5 hole 0.9: 1(-20.955,19.05) 2(-18.415,19.05) 3(-20.955,16.51) 4(-18.415,16.51) 5(-20.955,13.97) 6(-18.415,13.97) 7(-20.955,11.43) 8(-18.415,11.43) 9(-20.955,8.89) 10(-18.415,8.89) 11(-20.955,6.35) 12(-18.415,6.35) 13(-20.955,3.81) 14(-18.415,3.81) 15(-20.955,1.27) 16(-18.415,1.27) 17(-20.955,-1.27) 18(-18.415,-1.27) 19(-20.955,-3.81) 20(-18.415,-3.81) 21(-20.955,-6.35) 22(-18.415,-6.35) 23(-20.955,-8.89) 24(-18.415,-8.89) 25(-20.955,-11.43) 26(-18.415,-11.43) 27(-20.955,-13.97) 28(-18.415,-13.97) 29(-20.955,-16.51) 30(-18.415,-16.51) 31(-20.955,-19.05) 32(-18.415,-19.05) 33(-20.955,-21.59) 34(-18.415,-21.59) 35(-20.955,-24.13) 36(-18.415,-24.13) 37(-20.955,-26.67) 38(-18.415,-26.67) 39(-20.955,-29.21) 40(-18.415,-29.21) 41(-15.875,-29.21) 42(-15.875,-26.67) 43(-13.335,-29.21) 44(-13.335,-26.67) 45(-10.795,-29.21) 46(-10.795,-26.67) 47(-8.255,-29.21) 48(-8.255,-26.67) 49(6.985,-26.67) 50(6.985,-29.21) 51(9.525,-26.67) 52(9.525,-29.21) 53(12.065,-26.67) 54(12.065,-29.21) 55(14.605,-26.67) 56(14.605,-29.21) 57(17.145,-29.21) 58(19.685,-29.21) 59(17.145,-26.67) 60(19.685,-26.67) 61(17.145,-24.13) 62(19.685,-24.13) 63(17.145,-21.59) 64(19.685,-21.59) 65(17.145,-19.05) 66(19.685,-19.05) 67(17.145,-16.51) 68(19.685,-16.51) 69(17.145,-13.97) 70(19.685,-13.97) 71(17.145,-11.43) 72(19.685,-11.43) 73(17.145,-8.89) 74(19.685,-8.89) 75(17.145,-6.35) 76(19.685,-6.35) 77(17.145,-3.81) 78(19.685,-3.81) 79(17.145,-1.27) 80(19.685,-1.27) 81(17.145,1.27) 82(19.685,1.27) 83(17.145,3.81) 84(19.685,3.81) 85(17.145,6.35) 86(19.685,6.35) 87(17.145,8.89) 88(19.685,8.89) 89(17.145,11.43) 90(19.685,11.43) 91(17.145,13.97) 92(19.685,13.97) 93(17.145,16.51) 94(19.685,16.51) 95(17.145,19.05) 96(19.685,19.05) 97(14.605,16.51) 98(14.605,19.05) 99(12.065,16.51) 100(12.065,19.05) 101(9.525,16.51) 102(9.525,19.05) 103(6.985,16.51) 104(6.985,19.05) 105(4.445,16.51) 106(4.445,19.05) 107(1.905,16.51) 108(1.905,19.05) 109(-0.635,16.51) 110(-0.635,19.05) 111(-3.175,16.51) 112(-3.175,19.05) 113(-5.715,16.51) 114(-5.715,19.05) 115(-8.255,16.51) 116(-8.255,19.05) 117(-10.795,16.51) 118(-10.795,19.05) 119(-13.335,16.51) 120(-13.335,19.05) 121(-15.875,16.51) 122(-15.875,19.05)

## Nets
As in the schematic.

Pads without a net: H5 5 6; H6 5 6; H9 10; SW1 1 4; SW2 1 4; SW3 1 4; SW4 1 4; TOF1 6; U1 5 6 7 8 9 10 11 12 14 15 16 17 18 19 20 21 24 26 29 33 34 35 40 41 42 43 45 47 48 49 50 51 53 64 66 69 70 87 94 95 96 97 108 109 110 111 112 113 114 115 116 117 118 119 120 121 122; U31 2 8; U35 5 6; U36 7 8

## Via types
v1: diameter 0.61, hole 0.305, Top Layer to Bottom Layer, 134 vias

## Routing (per net, layer and track width the routed paths; a pad name or vN(x,y) marks a point on that pad's centre or on a via; arc(x,y) is an arc through that point)
3V_CAMERA: length 2.1
  Top Layer w0.762: 74.13,57.98 74.07,57.92 P3.7
  vias: v1(43.05,80.57) v1(43.05,79.04) v1(43.05,77.52) v1(44.58,80.57) v1(44.58,76)
3V_OTHERS: length 114.3
  Top Layer w0.381: 52.69,44.5 v1(50.09,44.5) ; 52.69,52.12 v1(50.09,52.12) ; 52.69,59.74 v1(50.09,59.74) ; 52.69,49.58 v1(50.09,49.58) ; 52.69,62.28 v1(50.09,62.28) ; 52.69,57.2 v1(50.09,57.2) ; R11.2 v1(50.16,64.82) ; 52.69,47.04 v1(50.09,47.04) ; 52.69,54.66 v1(50.09,54.66)
  Top Layer w0.762: R20.1 v1(34.01,42.8)
  Top Layer w1.27: P2.7 7.75,55.38 6.6,54.23 6.6,32.94 7.92,31.62 ; 31.24,6.98 v1(12.95,6.98) 6.6,13.33 6.6,30.31 7.92,31.62 ; 7.92,31.62 P1.2
  Bottom Layer w0.33: U35.18 31.88,2.75 31.88,6.48 v1(31.24,7.11)
  Bottom Layer w0.508: v1(12.95,6.98) 12.9,7.03 电机驱动1.1
5V_DCDC: length 13.6
  Top Layer w0.762: P3.11 R4.2
  Top Layer w1.27: P2.5 P2.6
  Bottom Layer w0.762: P2.6 13.72,54.52 13.72,58.78 P2.12
GND: length 16.7
  Top Layer w0.508: 79.37,31.81 v1(77.92,31.81) ; 79.37,36.39 v1(77.92,36.39) ; SW4.3 v1(77.92,41.08) ; 3V3电源指示.1 1.27,57.87 v1(1.27,59.56) ; VBAT电源指示.1 v1(80.22,64.77) ; 5V电源指示.1 v1(80.22,54.61) ; Q1.2 35.96,47.39 R21.2 ; SW1.3 v1(77.92,27.24) ; 摄像头电源指示.1 v1(80.22,59.69)
  Top Layer w0.762: U30.2 v1(72.64,22.22)
  vias: v1(2.54,34.25) v1(2.54,29.17) v1(2.54,24.09) v1(2.54,19.01) v1(2.54,13.93) v1(2.54,8.85) v1(2.94,84.71) v1(2.94,79.63) v1(2.94,74.55) v1(2.94,69.47) v1(5.08,34.25) v1(5.08,29.17) v1(5.08,24.09) v1(5.08,19.01) v1(5.08,13.93) v1(5.48,84.71) v1(5.48,79.63) v1(5.48,74.55) v1(5.48,69.47) v1(8.02,84.71) v1(8.02,79.63) v1(8.02,74.55) v1(10.16,42.93) v1(10.16,37.85) v1(10.16,13.93) v1(10.56,84.71) v1(10.56,79.63) v1(10.56,74.55) v1(12.7,42.93) v1(12.7,37.85) v1(12.7,34.25) v1(12.7,13.93) v1(13.1,84.71) v1(13.1,79.63) v1(15.24,48.01) v1(15.24,42.93) v1(15.24,37.85) v1(15.24,34.25) v1(15.24,24.09) v1(15.24,19.01) v1(15.64,84.71) v1(17.78,24.09) v1(17.78,19.01) v1(25.8,84.71) v1(25.78,62.36) v1(28.83,62.36) v1(37.21,84.2) v1(37.55,48.62) v1(39.75,84.2) v1(40.09,48.62) v1(42.29,84.2) v1(48.39,80.08) v1(48.39,76.27) v1(48.39,75) v1(49.02,77.98) v1(57.78,20.45) v1(60.45,75.82) v1(60.96,80.26) v1(62.87,20.45) v1(62.87,15.37) v1(66.93,83.18) v1(66.93,67.94) v1(66.93,62.86) v1(66.93,57.78) v1(66.93,52.7) v1(66.93,47.62) v1(67.94,20.45) v1(67.94,15.37) v1(67.94,10.29) v1(69.47,83.18) v1(72.01,83.18) v1(73.03,10.29) v1(74.55,83.18) v1(74.55,73.02) v1(74.55,47.62) v1(77.09,83.18) v1(77.09,78.1) v1(77.09,73.02) v1(77.09,47.62) v1(78.1,10.29) v1(79.63,83.18) v1(79.63,78.1) v1(79.63,73.02) v1(79.63,47.62) v1(80.52,23.24)
VBAT: length 24.8
  Top Layer w0.254: P2.4 18.55,50.3 19.18,50.93 27.69,50.93 28.83,52.07 R43.1
  Top Layer w0.762: P3.3 74.02,63 74.13,62.89
  Bottom Layer w1.27: P3.4 P3.3
VCCSTEER: length 10.1
  Top Layer w2.032: H8.2 P2.13 P2.14
  Bottom Layer w1.27: P3.14 P3.13
10.2: length 23
  Top Layer w0.203: U31.4 70.74,75.95 68.83,75.95 64.13,71.25 64.13,62.96 U1.86
10.5: length 19
  Top Layer w0.203: U1.88 63.37,64.74 63.37,72.26 68.33,77.22 U31.1
10.6: length 17.8
  Bottom Layer w0.203: U31.3 67.82,74.68 64.9,71.75 64.9,66.93 64.13,66.17 59.72,66.17 58.5,64.95
A8: length 10.9
  Top Layer w0.203: R43.2 R44.1 28.82,58.56 C19.1 21.64,58.56 U1.13
BUZZER: length 11.2
  Top Layer w0.203: 22.94,47.17 23.16,47.39 R46.2 33.96,47.39 R21.1
D0_CAM: length 12
  Top Layer w0.203: 45.21,81.41 45.21,81.28 46.23,80.26 46.23,72.99 U1.106
  Top Layer w0.254: 45.21,81.41 H9.15
D1_CAM: length 15
  Top Layer w0.254: 45.8,70.03 46.99,71.22 46.99,73.15 46.74,73.41 46.74,81.28 47.75,82.3 H9.13
D2_CAM: length 13
  Top Layer w0.254: U1.104 51.31,75.53 51.31,80.14 50.29,81.15 H9.11
D3_CAM: length 15.8
  Top Layer w0.254: H9.9 52.83,81.66 51.94,80.77 51.94,75.08 49.66,72.8 49.66,71.34 48.34,70.03
D4_CAM: length 13.3
  Top Layer w0.254: H9.7 55.37,81.15 53.97,79.76 53.97,75.66 U1.102
D5_CAM: length 17.5
  Top Layer w0.254: H9.5 57.91,81.53 56.64,80.26 56.64,76.45 55.75,75.56 54.61,75.56 52.07,73.02 52.07,71.22 50.88,70.03
D6_CAM: length 15.2
  Top Layer w0.254: H9.3 60.45,81.28 58.8,79.63 58.8,76.51 58.49,76.2 57.05,76.2 U1.100
D7_CAM: length 20.4
  Top Layer w0.254: 53.42,70.03 54.74,71.34 54.74,73.02 56.26,74.55 60.58,74.55 62.1,76.07 62.1,80.01 62.99,80.9 H9.1
DIR1: length 33.9
  Bottom Layer w0.203: 电机驱动1.3 16.14,9.53 21.59,14.99 21.59,28.04 22.94,29.39
DIR2: length 27.4
  Bottom Layer w0.203: 电机驱动1.5 15.34,12.03 19.3,16 19.3,25.75 U1.37
ENCODER1A: length 42.6
  Bottom Layer w0.203: v1(20.64,84.19) 20.64,82.49 21.59,81.53 49.4,81.53 51.94,78.99 51.94,76.58 55.96,72.57 U1.98
ENCODER1B: length 36
  Bottom Layer w0.203: v1(20.66,78.55) 20.66,75.78 18.03,73.15 18.03,46.99 U1.23
ENCODER2A: length 50.9
  Top Layer w0.203: 33.21,84.23 33.21,82.11 31.81,80.71 29.22,80.71 26.89,78.38 v1(26.89,77.15)
  Bottom Layer w0.203: U1.25 20.5,42.09 21.72,43.31 25.02,43.31 26.89,45.18 v1(26.89,77.15)
ENCODER2B: length 44.4
  Top Layer w0.203: U1.85 56.64,61.73 56.64,65.15 55.37,66.42 41.28,66.42 39.5,68.2 39.5,78.1 36.45,81.15 34.04,81.15 33.31,80.43 33.31,78.16
GPIO0: length 46
  Top Layer w0.203: v1(24,15.37) 24.89,14.48 34.11,14.48 42.11,6.48 43.39,6.48 U35.7
  Bottom Layer w0.203: U1.32 23.94,33.46 23.94,15.42 v1(24,15.37)
HLSIL: length 53.2
  Top Layer w0.203: U35.8 44.5,2.82 44.5,4.78 43.43,5.84 42.04,5.84 34.54,13.33 25.27,13.33 v1(25.15,13.46)
  Bottom Layer w0.203: v1(25.15,13.46) 25.15,18.52 24.38,19.28 24.38,34.63 23.33,35.69 21.62,35.69 U1.31
IMU_CS: length 30.1
  Bottom Layer w0.203: U1.56 55.96,15.67 64.39,7.24 69.66,7.24 U36.6
IMU_MISO: length 32
  Bottom Layer w0.203: U36.5 68.31,6.1 64.39,6.1 54.61,15.88 54.61,25.5 U1.55
IMU_MOSI: length 23.9
  Top Layer w0.203: U36.4 67.71,5.31 v1(62.74,10.29)
  Bottom Layer w0.203: v1(62.74,10.29) 58.5,14.52 U1.57
IMU_SCK: length 25
  Bottom Layer w0.203: U1.54 53.42,15.92 65.15,4.19 U36.3
KEY0: length 42.9
  Top Layer w0.203: SW1.2 73.84,25.09 71.65,27.28 71.65,39.09 64.77,45.97 64.77,50.29 61.59,53.47 59.82,53.47 58.5,54.78 U1.81 56.09,57.2 R8.1
KEY1: length 40.6
  Top Layer w0.203: 74.87,29.66 73.46,29.66 71.96,31.17 71.96,39.22 65.07,46.1 65.07,50.75 61.04,54.78 U1.82 60.28,54.79 59.06,56.01 57.95,56.01 55.66,58.29 55.14,58.29 54.76,58.67 R9.1
KEY2: length 38.4
  Top Layer w0.203: 74.87,34.24 74.82,34.29 73.66,34.29 73.29,34.66 73.29,38.52 65.38,46.43 65.38,52.35 61.59,56.13 59.69,56.13 58.5,57.32 U1.83 57.15,58.68 57.15,59.05 55.5,60.71 55.12,60.71 54.76,61.06 R10.1
KEY3: length 36
  Top Layer w0.203: 61.04,57.32 65.79,52.58 65.79,47.12 73.97,38.93 SW4.2 ; 61.04,57.32 59.82,58.55 58.17,58.55 55.81,60.9 55.81,63.01 55.57,63.25 55.12,63.25 54.76,63.6 R11.1 ; 61.04,57.32 U1.84
KEY_A: length 42.6
  Top Layer w0.203: U30.1 71.35,25.5 71.35,38.96 63.63,46.69 63.63,47.12 U1.78 59.82,50.93 58.04,50.93 57.15,51.82 57.15,53.34 55.83,54.66 R15.1
KEY_B: length 49.1
  Top Layer w0.203: U30.4 78.56,18.29 76.93,18.29 75.66,19.56 74.68,19.56 73.79,18.67 72.64,18.67 70.74,20.57 70.74,38.65 64.76,44.63 U1.74 59.95,45.72 58.17,45.72 56.95,44.5 R12.1
KEY_C: length 41.5
  Top Layer w0.203: U30.3 71.04,21.84 71.04,38.78 61.56,48.26 59.95,48.26 U1.77 56.09,52.12 R16.1
KEY_D: length 48.6
  Top Layer w0.203: v1(63.37,43.94) 70.13,37.19 70.13,20.32 72.54,17.91 74.35,17.91 74.85,18.41 75.44,18.41 76.71,17.14 76.71,16.18 U30.6 ; R14.1 56.09,49.58 58.5,47.17
  Bottom Layer w0.203: v1(63.37,43.94) 61.34,45.97 59.69,45.97 58.5,47.17
KEY_M: length 49.4
  Top Layer w0.203: R13.1 56.72,47.04 57.66,46.1 60.07,46.1 61.04,47.07 61.04,47.17 ; v1(64.64,43.56) 65.4,43.56 70.43,38.53 70.43,20.45 72.59,18.29 74.17,18.29 74.93,19.05 75.56,19.05 78.8,15.82 U30.5
  Bottom Layer w0.203: 61.04,47.17 64.64,43.56 v1(64.64,43.56)
PCLK_OUT: length 12.3
  Top Layer w0.203: U1.91 59.56,68.55 59.56,72.9 62.99,76.33 H9.2
PWM1: length 32.8
  Bottom Layer w0.203: U1.38 22.94,26.75 21.94,25.75 21.94,13.8 16.42,8.28 电机驱动1.2
PWM2: length 26.2
  Bottom Layer w0.203: 电机驱动1.4 15.61,10.78 20.4,15.57 U1.39
RX0: length 10
  Bottom Layer w0.203: H4.3 64.9,33.65 64.9,34.69 62.58,37.01 U1.68
RXD_CAM: length 13.7
  Bottom Layer w0.203: U1.92 59.82,68.71 58.29,68.71 57.28,69.72 57.28,74.93 55.37,76.83 v1(55.37,77.98)
SERVO: length 2.6
  Top Layer w0.203: R41.2 25.47,39.55 U1.28
SR0: length 30.7
  Top Layer w0.203: U35.11 38.49,6.29 37.78,6.29 32.89,11.18 v1(29.08,11.18)
  Bottom Layer w0.203: v1(29.08,11.18) 29.03,11.23 29.03,25.84 U1.44
SR1: length 34.4
  Top Layer w0.203: U35.12 42.04,2.84 42.04,4.44 34.54,11.94 v1(29.59,11.94)
  Bottom Layer w0.203: v1(29.59,11.94) 29.56,11.97 29.56,25.49 30.56,26.5 U1.46
SR2: length 70.2
  Top Layer w0.203: v1(39.37,10.79) 39.37,13.46 v1(38.48,14.35)
  Bottom Layer w0.203: U35.13 39.37,5.25 v1(39.37,10.79) ; v1(38.48,14.35) 38.48,14.41 37.85,15.04 37.85,36.32 44.32,42.8 44.32,68.96 43.26,70.03
SR3: length 48.4
  Top Layer w0.203: 31.7,10.54 v1(31.62,10.54) 36.83,5.33 36.83,2.88 U35.14
  Bottom Layer w0.203: v1(31.62,10.54) 31.62,33.4 26.85,38.18 21.77,38.18 U1.27
SR4: length 54.6
  Top Layer w0.203: v1(52.85,36.44) U1.71
  Bottom Layer w0.203: U35.15 36.83,5.25 36.83,10.54 38.1,11.81 47.37,11.81 49.28,13.72 49.28,21.21 47.24,23.24 47.24,30.83 v1(52.85,36.44)
SR5: length 62.8
  Top Layer w0.203: v1(52.07,37.21) 52.07,37.34 58.17,43.43 59.69,43.43 U1.72
  Bottom Layer w0.203: v1(52.07,37.21) 46.61,31.75 46.61,22.86 48.64,20.83 48.64,14.1 46.99,12.45 37.85,12.45 35.64,10.24 35.64,5.92 34.29,4.57 34.29,2.88 U35.16
SR6: length 58.3
  Top Layer w0.203: v1(51.18,37.46) 58.34,44.63 U1.73
  Bottom Layer w0.203: U35.17 34.49,5.45 34.49,10.23 37.34,13.08 46.61,13.08 47.88,14.35 47.88,20.45 45.85,22.48 45.85,32.13 v1(51.18,37.46)
SYNC: length 25.9
  Bottom Layer w0.203: U1.52 50.88,11 44.45,4.57 44.45,2.71 U35.10
TFT_BL: length 62.2
  Top Layer w0.203: P1.8 15.62,22.35 61.09,22.35 62.52,23.79 62.52,27.9 61.04,29.39
TFT_CS: length 63.1
  Top Layer w0.203: U1.60 59.57,28.32 57.91,28.32 55.75,30.48 16.64,30.48 11.51,25.35 8.97,25.35 8.11,24.49 8.11,20.47 P1.7
TFT_DC: length 56.1
  Top Layer w0.203: P1.6 16.13,27.94 56.44,27.94 57.15,27.23 57.15,26.42 57.91,25.65 59.69,25.65 U1.58
TFT_RES: length 51.2
  Top Layer w0.203: 9.65,24 11.56,24 15.88,28.32 57.03,28.32 U1.59
TFT_SCK: length 55.3
  Top Layer w0.203: P1.3 12.57,29.08 16.51,33.02 59.06,33.02 59.5,32.57 59.5,30.42 58.5,29.42 58.5,29.39
TFT_SDA: length 51.1
  Top Layer w0.203: U1.63 58.47,31.93 57.4,30.86 16.13,30.86 11.81,26.54 P1.4
TLD_RX: length 47.5
  Top Layer w0.203: U35.9 43.26,4.11 34.67,12.7 v1(26.67,12.7)
  Bottom Layer w0.203: v1(26.67,12.7) 26.67,35.81 25.48,37.01 U1.30
TOF_SCL: length 45.4
  Bottom Layer w0.203: 61.04,52.25 59.72,50.93 57.66,50.93 41.51,34.78 TOF1.3
TOF_SDA: length 45.5
  Bottom Layer w0.203: TOF1.4 39.01,35.07 56.18,52.25 58.5,52.25
TOF_XSHUT: length 40
  Top Layer w0.203: v1(36.45,33.78) 37.13,34.47 U1.65
  Bottom Layer w0.203: v1(36.45,33.78) 36.45,16.19 TOF1.5
TX0: length 14.4
  Bottom Layer w0.203: H4.4 63.88,32.13 63.88,34.54 62.61,35.81 59.69,35.81 U1.67
TXD_CAM: length 9.3
  Bottom Layer w0.203: 58.5,70.03 59.82,71.34 59.82,76.07 v1(57.91,77.98)
VSYNC_CAM: length 22.3
  Top Layer w0.203: v1(50.29,68.45) 56.11,68.45 58.4,66.17 59.82,66.17 61.04,64.95
  Bottom Layer w0.203: v1(50.29,68.45) 49.66,69.09 49.66,74.68 50.29,75.31 v1(50.29,77.98)
$1N2787: length 1.9
  Top Layer w0.762: 76.13,52.81 78.02,52.81 78.02,52.82
$1N2799: length 1.9
  Top Layer w0.762: 78.02,57.98 78.02,57.98 76.13,57.98
$1N2800: length 1.8
  Top Layer w0.762: 3V3电源指示.2 R7.1
$1N2856: length 6.9
  Top Layer w0.508: BUZZER1.1 41.3,44.89 R20.2
$1N2858: length 8
  Top Layer w0.508: BUZZER1.2 41.08,51.35 Q1.3
$1N3556: length 1.9
  Top Layer w0.762: 76.13,62.89 78,62.89 78.02,62.86
$1N4756: length 40.2
  Bottom Layer w0.203: 4.44,60.46 4.44,46.13 9.81,40.77 26.47,40.77 v1(27.62,39.62)
$1N11903: length 2.1
  Top Layer w0.203: R46.1 32.04,49.35 Q1.1

## Copper pours and planes (outline as drawn; the poured copper is in the pictures)
3V_CAMERA on Top Layer: 41.8,81.44 44.41,81.44 45.97,79.88 45.97,74.9 45.55,74.47 44.55,74.47 41.53,77.49 41.53,81.17
3V_CAMERA on Inner1: 69.12,55.76 71.03,55.76 71.03,55 69.12,55
3V_CAMERA on Inner1: 69.12,58.3 69.88,58.3 69.88,56.38 69.12,56.38
3V_CAMERA on Inner1: 71.66,58.3 73.57,58.3 73.57,57.54 71.66,57.54
3V_CAMERA on Inner1: 70.5,58.3 72.42,58.3 72.42,57.54 70.5,57.54
3V_CAMERA on Inner1: 67.96,55.76 69.88,55.76 69.88,55 67.96,55
3V_CAMERA on Inner1: 69.12,56.91 69.88,56.91 69.88,55 69.12,55
3V_CAMERA on Inner1: 71.66,56.91 72.42,56.91 72.42,55 71.66,55
3V_CAMERA on Inner1: 70.5,55.76 72.42,55.76 72.42,55 70.5,55
3V_CAMERA on Inner1: 71.66,58.3 72.42,58.3 72.42,56.38 71.66,56.38
3V_CAMERA on Inner1: 41.68,85.95 74.78,85.95 74.78,54.51 41.68,54.51
3V_CAMERA on Inner1: 67.96,58.3 69.88,58.3 69.88,57.54 67.96,57.54
3V_CAMERA on Inner1: 71.66,55.76 73.57,55.76 73.57,55 71.66,55
3V_CAMERA on Inner1: 69.12,58.3 71.03,58.3 71.03,57.54 69.12,57.54
3V_OTHERS on Top Layer: 5.97,32.89 5.97,29.84 7.37,31.24 7.37,31.62 6.1,32.89
3V_OTHERS on Top Layer: 6.73,58.29 7.49,59.05 13.33,59.05 14.35,60.07 14.35,74.96 15.63,76.24 21.38,76.24 21.84,76.71 21.84,80.14 22.35,80.64 23.88,80.64 24.51,80.01 24.51,76.76 24.93,76.34 33.92,76.34 34.54,76.96 34.54,79.92 35.14,80.52 36.58,80.52 37.21,79.88 37.21,76.89 37.68,76.41 38.5,76.41 39.23,75.68 39.23,74.28 38.73,73.79 20.19,73.79 19.05,72.64 19.05,55.88 17.4,54.23 7.11,54.23 6.73,54.61
3V_OTHERS on Bottom Layer: 24.77,0 31.37,0 33.15,-1.78 33.15,-5.72 34.29,-6.86 33.78,-7.37 26.34,-7.37 22.61,-3.63 22.61,-2.16
3V_OTHERS on Inner1: 0.26,86 66.45,86 66.45,0.36 0.26,0.36
5V_DCDC on Inner1: 69.09,69.98 70.91,69.98 70.91,69.21 69.09,69.21
5V_DCDC on Inner1: 70.5,53.22 72.42,53.22 72.42,52.46 70.5,52.46
5V_DCDC on Inner1: 67.44,36.19 69.31,36.19 69.31,35.43 67.44,35.43
5V_DCDC on Inner1: 66.33,36.19 68.2,36.19 68.2,35.43 66.33,35.43
5V_DCDC on Inner1: 22.56,70.41 23.32,70.41 23.32,68.64 22.56,68.64
5V_DCDC on Inner1: 22.56,72.95 23.32,72.95 23.32,71.18 22.56,71.18
5V_DCDC on Inner1: 11.66,60.84 13.57,60.84 13.57,60.08 11.66,60.08
5V_DCDC on Inner1: 69.09,69.97 69.85,69.97 69.85,68.16 69.09,68.16
5V_DCDC on Inner1: 9.12,60.84 11.03,60.84 11.03,60.08 9.12,60.08
5V_DCDC on Inner1: 67.44,37.3 68.2,37.3 68.2,35.44 67.44,35.44
5V_DCDC on Inner1: 22.56,73.95 23.32,73.95 23.32,72.19 22.56,72.19
5V_DCDC on Inner1: 70.5,60.84 72.42,60.84 72.42,60.08 70.5,60.08
5V_DCDC on Inner1: 22.56,72.95 24.33,72.95 24.33,72.19 22.56,72.19
5V_DCDC on Inner1: 10.5,60.84 12.42,60.84 12.42,60.08 10.5,60.08
5V_DCDC on Inner1: 7.96,60.84 9.88,60.84 9.88,60.08 7.96,60.08
5V_DCDC on Inner1: 69.12,53.22 71.03,53.22 71.03,52.46 69.12,52.46
5V_DCDC on Inner1: 69.09,71.03 69.85,71.03 69.85,69.22 69.09,69.22
5V_DCDC on Inner1: 21.55,70.41 23.32,70.41 23.32,69.65 21.55,69.65
5V_DCDC on Inner1: 71.66,60.84 73.57,60.84 73.57,60.08 71.66,60.08
5V_DCDC on Inner1: 21.55,72.95 23.32,72.95 23.32,72.19 21.55,72.19
5V_DCDC on Inner1: 22.56,71.41 23.32,71.41 23.32,69.65 22.56,69.65
5V_DCDC on Inner1: 66.07,72.12 81.12,72.12 81.12,34 66.07,34
5V_DCDC on Inner1: 69.12,60.84 71.03,60.84 71.03,60.08 69.12,60.08
5V_DCDC on Inner1: 71.66,53.22 73.57,53.22 73.57,52.46 71.66,52.46
5V_DCDC on Inner1: 22.56,70.41 24.33,70.41 24.33,69.65 22.56,69.65
5V_DCDC on Inner1: 6.25,74.9 25.5,74.9 25.5,59.08 6.25,59.08
5V_DCDC on Inner1: 67.96,53.22 69.88,53.22 69.88,52.46 67.96,52.46
GND on Top Layer: 34.67,85.72 35.05,86.11 44.01,86.11 44.32,85.8 44.32,82.94 43.67,82.3 35.31,82.3 34.67,82.93
GND on Top Layer: 0,36.86 1.36,38.23 4.32,38.23 5.59,36.96 5.59,12.45 12.06,5.97 30.61,5.97 31.88,4.7 31.88,1.08 30.92,0.13 3.3,0.13 0,3.42
GND on Top Layer: 35.8,50.33 40.35,50.33 41.15,49.53 41.15,46.51 40.72,46.08 35.66,46.08 35.01,46.73 35.01,49.54
GND on Top Layer: 47.12,81.03 47.5,81.41 49.15,81.41 49.66,80.9 49.66,74.64 48.75,73.73 47.81,73.73 47.5,74.04 47.5,74.29 47.12,74.68
GND on Top Layer: 28.57,81.94 28.57,85.6 27.81,86.36 2.94,86.36 0.4,83.82 0.4,65.64 1.65,64.39 12.57,64.39 13.84,65.66 13.84,77.72 17.09,80.96 27.6,80.96
GND on Top Layer: 59.06,79.5 60.52,80.96 61.28,80.96 61.85,80.39 61.85,76.33 60.71,75.18 59.56,75.18 59.06,75.69
GND on Top Layer: 7.62,48.13 8.51,49.02 16.01,49.02 18.03,46.99 18.03,35.43 15.37,32.77 8.64,32.77 7.62,33.78
GND on Top Layer: 24.77,63.5 29.84,63.5 30.23,63.12 30.23,59.94 29.97,59.69 24.65,59.69 24.38,59.96 24.38,63.11
GND on Top Layer: 49.74,0.13 48.98,0.89 48.98,4.87 42.54,11.3 42.54,19.69 44.07,21.21 68.43,21.21 72.03,17.6 73.2,17.6 79.63,11.18 79.63,1.4 78.36,0.13
GND on Top Layer: 64.39,84.34 66.03,85.98 79.38,85.98 81.41,83.95 81.41,43.18 80.77,42.54 70.87,42.54 66.29,47.12 66.29,71.5 68.2,73.41 73.41,73.41 74.55,74.55 74.55,78.49 73.41,79.63 65.8,79.63 64.39,81.04
GND on Top Layer: 77.82,21.62 77.82,23.47 78.48,24.13 81.03,24.13 81.28,23.88 81.28,20.24 80.57,19.53 79.91,19.53
GND on Bottom Layer: 0,35.82 2.66,38.48 16.64,38.48 18.29,36.83 18.29,18.8 12.15,12.66 3.97,12.66 3.56,12.25 3.56,4.51 2.81,3.77 0,3.77
GND on Inner2: 0.26,86.1 81.28,86.1 81.28,0.26 0.26,0.26
VBAT on Inner1: 53.04,5.6 53.8,5.6 53.8,3.69 53.04,3.69
VBAT on Inner1: 6.12,52.68 56.87,52.68 56.87,0.41 6.12,0.41
VBAT on Inner1: 53.04,3.06 53.8,3.06 53.8,1.15 53.04,1.15
VBAT on Inner1: 27.64,5.6 28.4,5.6 28.4,3.69 27.64,3.69
VBAT on Inner1: 26.48,1.91 28.4,1.91 28.4,1.14 26.48,1.14
VBAT on Inner1: 9.12,50.68 11.03,50.68 11.03,49.92 9.12,49.92
VBAT on Inner1: 27.64,4.44 28.4,4.44 28.4,2.53 27.64,2.53
VBAT on Inner1: 53.04,1.91 54.96,1.91 54.96,1.14 53.04,1.14
VBAT on Inner1: 10.5,50.68 12.42,50.68 12.42,49.92 10.5,49.92
VBAT on Inner1: 26.48,4.44 28.4,4.44 28.4,3.68 26.48,3.68
VBAT on Inner1: 7.96,50.68 9.88,50.68 9.88,49.92 7.96,49.92
VBAT on Inner1: 11.66,50.68 13.57,50.68 13.57,49.92 11.66,49.92
VBAT on Inner1: 53.04,4.44 53.8,4.44 53.8,2.53 53.04,2.53
VBAT on Inner1: 53.04,4.44 54.96,4.44 54.96,3.68 53.04,3.68
VBAT on Inner1: 27.64,3.06 28.4,3.06 28.4,1.15 27.64,1.15

Small or netless copper shapes (teardrops, artwork), in the pictures only: 161 on Top Layer, 70 on Bottom Layer, 82 on Inner2

## Text on the board
Bottom Silkscreen Layer: DIR2 | PWM2 | DIR1 | PWM1 | 3V3
Top Layer: 代鹏涛 申杰文 | 宛陵毕方 | 2024/7/10
Top Silkscreen Layer: GND | VSTEER | 5V | 3V3_A | VBAT | RX | TX | VABT | TOF1 | XS | 15.07 | 11.03 | SDA | 11.06 | SCL | 3V3 | SCK | MISO | CS | 10.5 | 10.6 | Tx | Rx | 10.2 | NC | RTS | 02.8 | 33.5 | B | A | 33.7 | RES | DC | BL | 10.1 | PWM | MOSI
